# EAGLE design apple-mini (EAGLE 7.4.0)
Apple Mini 1 Schematic Source: http://github.com/sstallion/apple-mini/
AUTHOR: S. Stallion; REV: A; SUBTITLE: http://github.com/sstallion/apple-mini/; TITLE: APPLE MINI 1

## Sheet 1 of 3: I/O & Supply
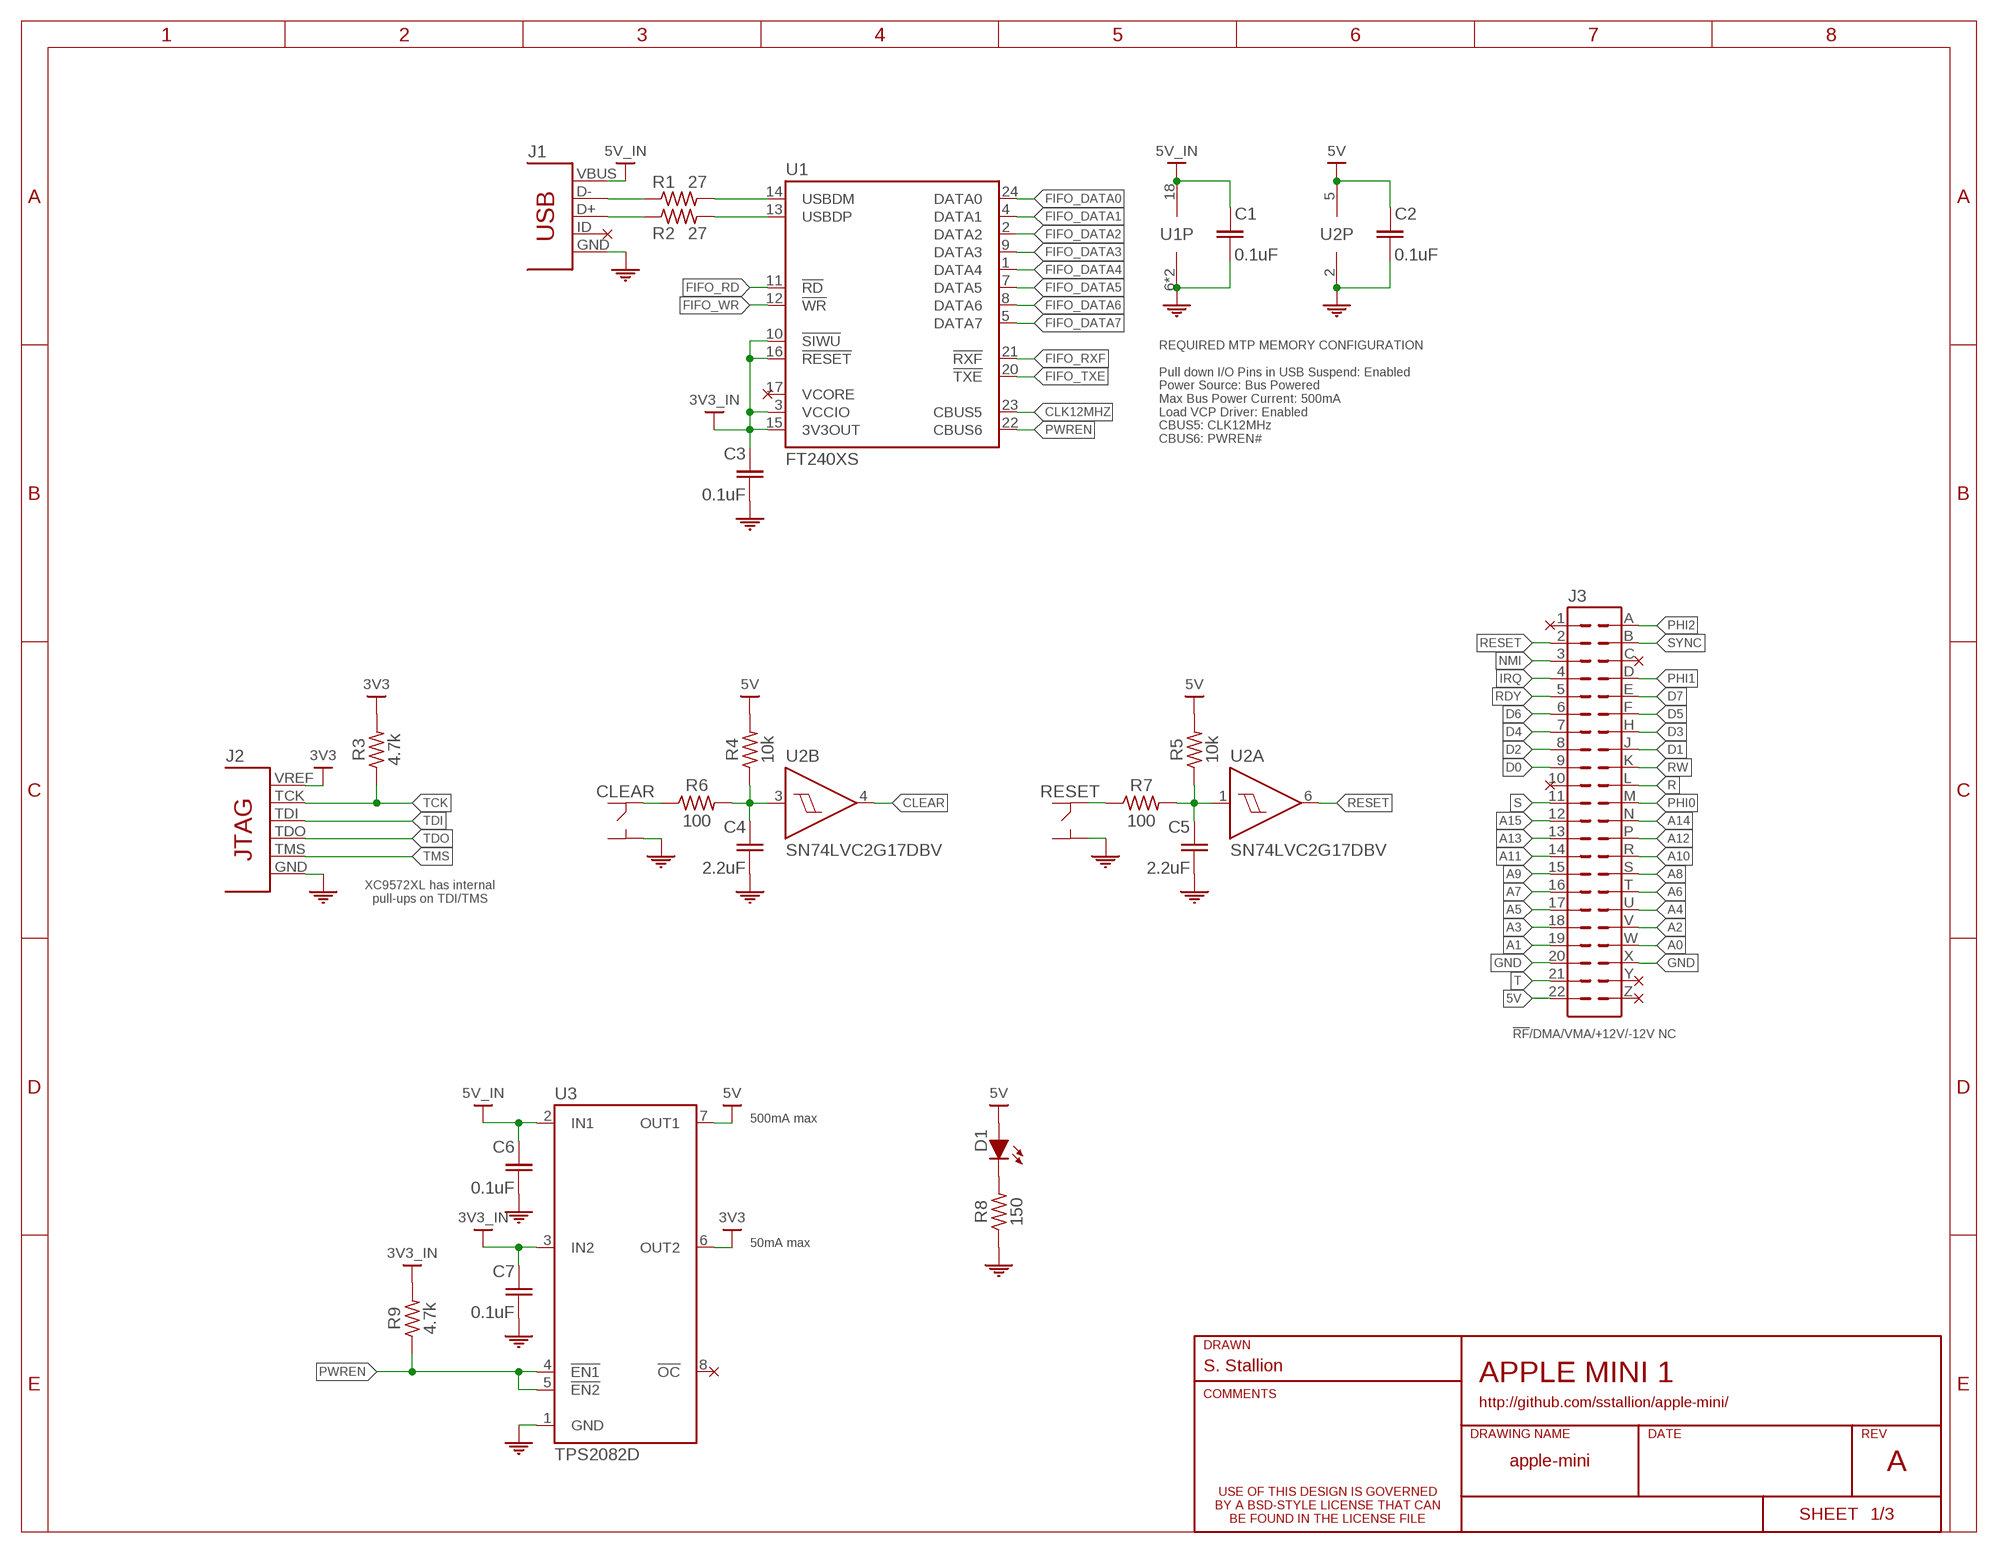
[diagram p0: schematic, sheet 1]
TITLE1 (TITLE): COMMENTS: N/A; SHEET_NAME: I/O & Supply

### Parts
C1  0.1uF  C0603  [0603]
C2  0.1uF  C0603  [0603]
C3  0.1uF  C0603  [0603]
C4  2.2uF  C0603  [0603]
C5  2.2uF  C0603  [0603]
C6  0.1uF  C0603  [0603]
C7  0.1uF  C0603  [0603]
CLEAR  TACTSW  [SMTR92]
D1  CHIPLED  [0603]
J1  USBMICRO  [10118193-0001LF]
J2  JTAG  [PH07-2-SMT]
J3  RBM22DRTN  [M22DRTN]
R1  27  R0402  [0402]
R2  27  R0402  [0402]
R3  4.7k  R0603  [0603]
R4  10k  R0603  [0603]
R5  10k  R0603  [0603]
R6  100  R0603  [0603]
R7  100  R0603  [0603]
R8  150  R0603  [0603]
R9  4.7k  R0603  [0603]
RESET  TACTSW  [SMTR92]
U1  FT240XS  [SSOP24]
U2  SN74LVC2G17DBV  [SOT23-6]
U3  TPS2082D  [SOIC8]

### Nets
3V3 [supply]: J2.2(VREF) R3.2 U3.6(OUT2) ; also sheet 3
3V3_IN [supply]: C3.1 C7.1 R9.2 U1.3(VCCIO) U1.10(!SIWU) U1.15(3V3OUT) U1.16(!RESET) U3.3(IN2)
5V [supply]: C2.1 D1.2 J3.22 R4.2 R5.2 U2.5(P:VCC) U3.7(OUT1) ; also sheet 2
5V_IN [supply]: C1.1 C6.1 J1.1 U1.18(VCC) U3.2(IN1)
A0: J3.W ; also sheet 2
A1: J3.19 ; also sheet 2
A2: J3.V ; also sheet 2
A3: J3.18 ; also sheet 2
A4: J3.U ; also sheet 2
A5: J3.17 ; also sheet 2
A6: J3.T ; also sheet 2
A7: J3.16 ; also sheet 2
A8: J3.S ; also sheet 2
A9: J3.15 ; also sheet 2
A10: J3.R ; also sheet 2
A11: J3.14 ; also sheet 2
A12: J3.P ; also sheet 2,3
A13: J3.13 ; also sheet 2,3
A14: J3.N ; also sheet 2,3
A15: J3.12 ; also sheet 2,3
CLEAR: U2.4(B:Y) ; also sheet 3
CLK12MHZ: U1.23(CBUS5) ; also sheet 3
D0: J3.9 ; also sheet 2
D1: J3.J ; also sheet 2
D2: J3.8 ; also sheet 2
D3: J3.H ; also sheet 2
D4: J3.7 ; also sheet 2
D5: J3.F ; also sheet 2
D6: J3.6 ; also sheet 2
D7: J3.E ; also sheet 2
FIFO_DATA0: U1.24(DATA0) ; also sheet 3
FIFO_DATA1: U1.4(DATA1) ; also sheet 3
FIFO_DATA2: U1.2(DATA2) ; also sheet 3
FIFO_DATA3: U1.9(DATA3) ; also sheet 3
FIFO_DATA4: U1.1(DATA4) ; also sheet 3
FIFO_DATA5: U1.7(DATA5) ; also sheet 3
FIFO_DATA6: U1.8(DATA6) ; also sheet 3
FIFO_DATA7: U1.5(DATA7) ; also sheet 3
FIFO_RD: U1.11(!RD) ; also sheet 3
FIFO_RXF: U1.21(!RXF) ; also sheet 3
FIFO_TXE: U1.20(!TXE) ; also sheet 3
FIFO_WR: U1.12(!WR) ; also sheet 3
GND [supply]: C1.2 C2.2 C3.2 C4.2 C5.2 C6.2 C7.2 CLEAR.3 CLEAR.4 J1.5 J1.6 J1.7 J1.8 J1.9 J2.3(GND) J2.5(GND) J2.7(GND) J2.9(GND) J2.11(GND) J3.20 J3.X R8.1 RESET.3 RESET.4 U1.6(GND) U1.19(GND) U2.2(P:GND) U3.1(GND) ; also sheet 2,3
IRQ: J3.4 ; also sheet 2
N$1: D1.1 R8.2
N$1_N: J1.2 R1.1
N$1_P: J1.3 R2.1
N$2: CLEAR.1 CLEAR.2 R6.1
N$2_N: R1.2 U1.14(USBDM)
N$2_P: R2.2 U1.13(USBDP)
N$3: R7.1 RESET.1 RESET.2
N$4: C4.1 R4.1 R6.2 U2.3(B:A)
N$5: C5.1 R5.1 R7.2 U2.1(A:A)
NMI: J3.3 ; also sheet 2
PHI0: J3.M ; also sheet 2,3
PHI1: J3.D ; also sheet 2
PHI2: J3.A ; also sheet 2,3
PWREN: R9.1 U1.22(CBUS6) U3.4(!EN1) U3.5(!EN2)
R: J3.L ; also sheet 3
RDY: J3.5 ; also sheet 2
RESET: J3.2 U2.6(A:Y) ; also sheet 2,3
RW: J3.K ; also sheet 2
S: J3.11 ; also sheet 3
SYNC: J3.B ; also sheet 2
T: J3.21 ; also sheet 3
TCK: J2.6(TCK) R3.1 ; also sheet 3
TDI: J2.10(TDI) ; also sheet 3
TDO: J2.8(TDO) ; also sheet 3
TMS: J2.4(TMS) ; also sheet 3
Unconnected: J1.4 J3.1 J3.10 J3.C J3.Y J3.Z U3.8(!OC)

### Notes on the sheet
- REQUIRED MTP MEMORY CONFIGURATION
  
  Pull down I/O Pins in USB Suspend: Enabled
  Power Source: Bus Powered
  Max Bus Power Current: 500mA
  Load VCP Driver: Enabled
  CBUS5: CLK12MHz
  CBUS6: PWREN#
- XC9572XL has internal
  pull-ups on TDI/TMS
- !RF!/DMA/VMA/+12V/-12V NC
- 500mA max
- 50mA max

## Sheet 2 of 3: MPU PIA & Memory
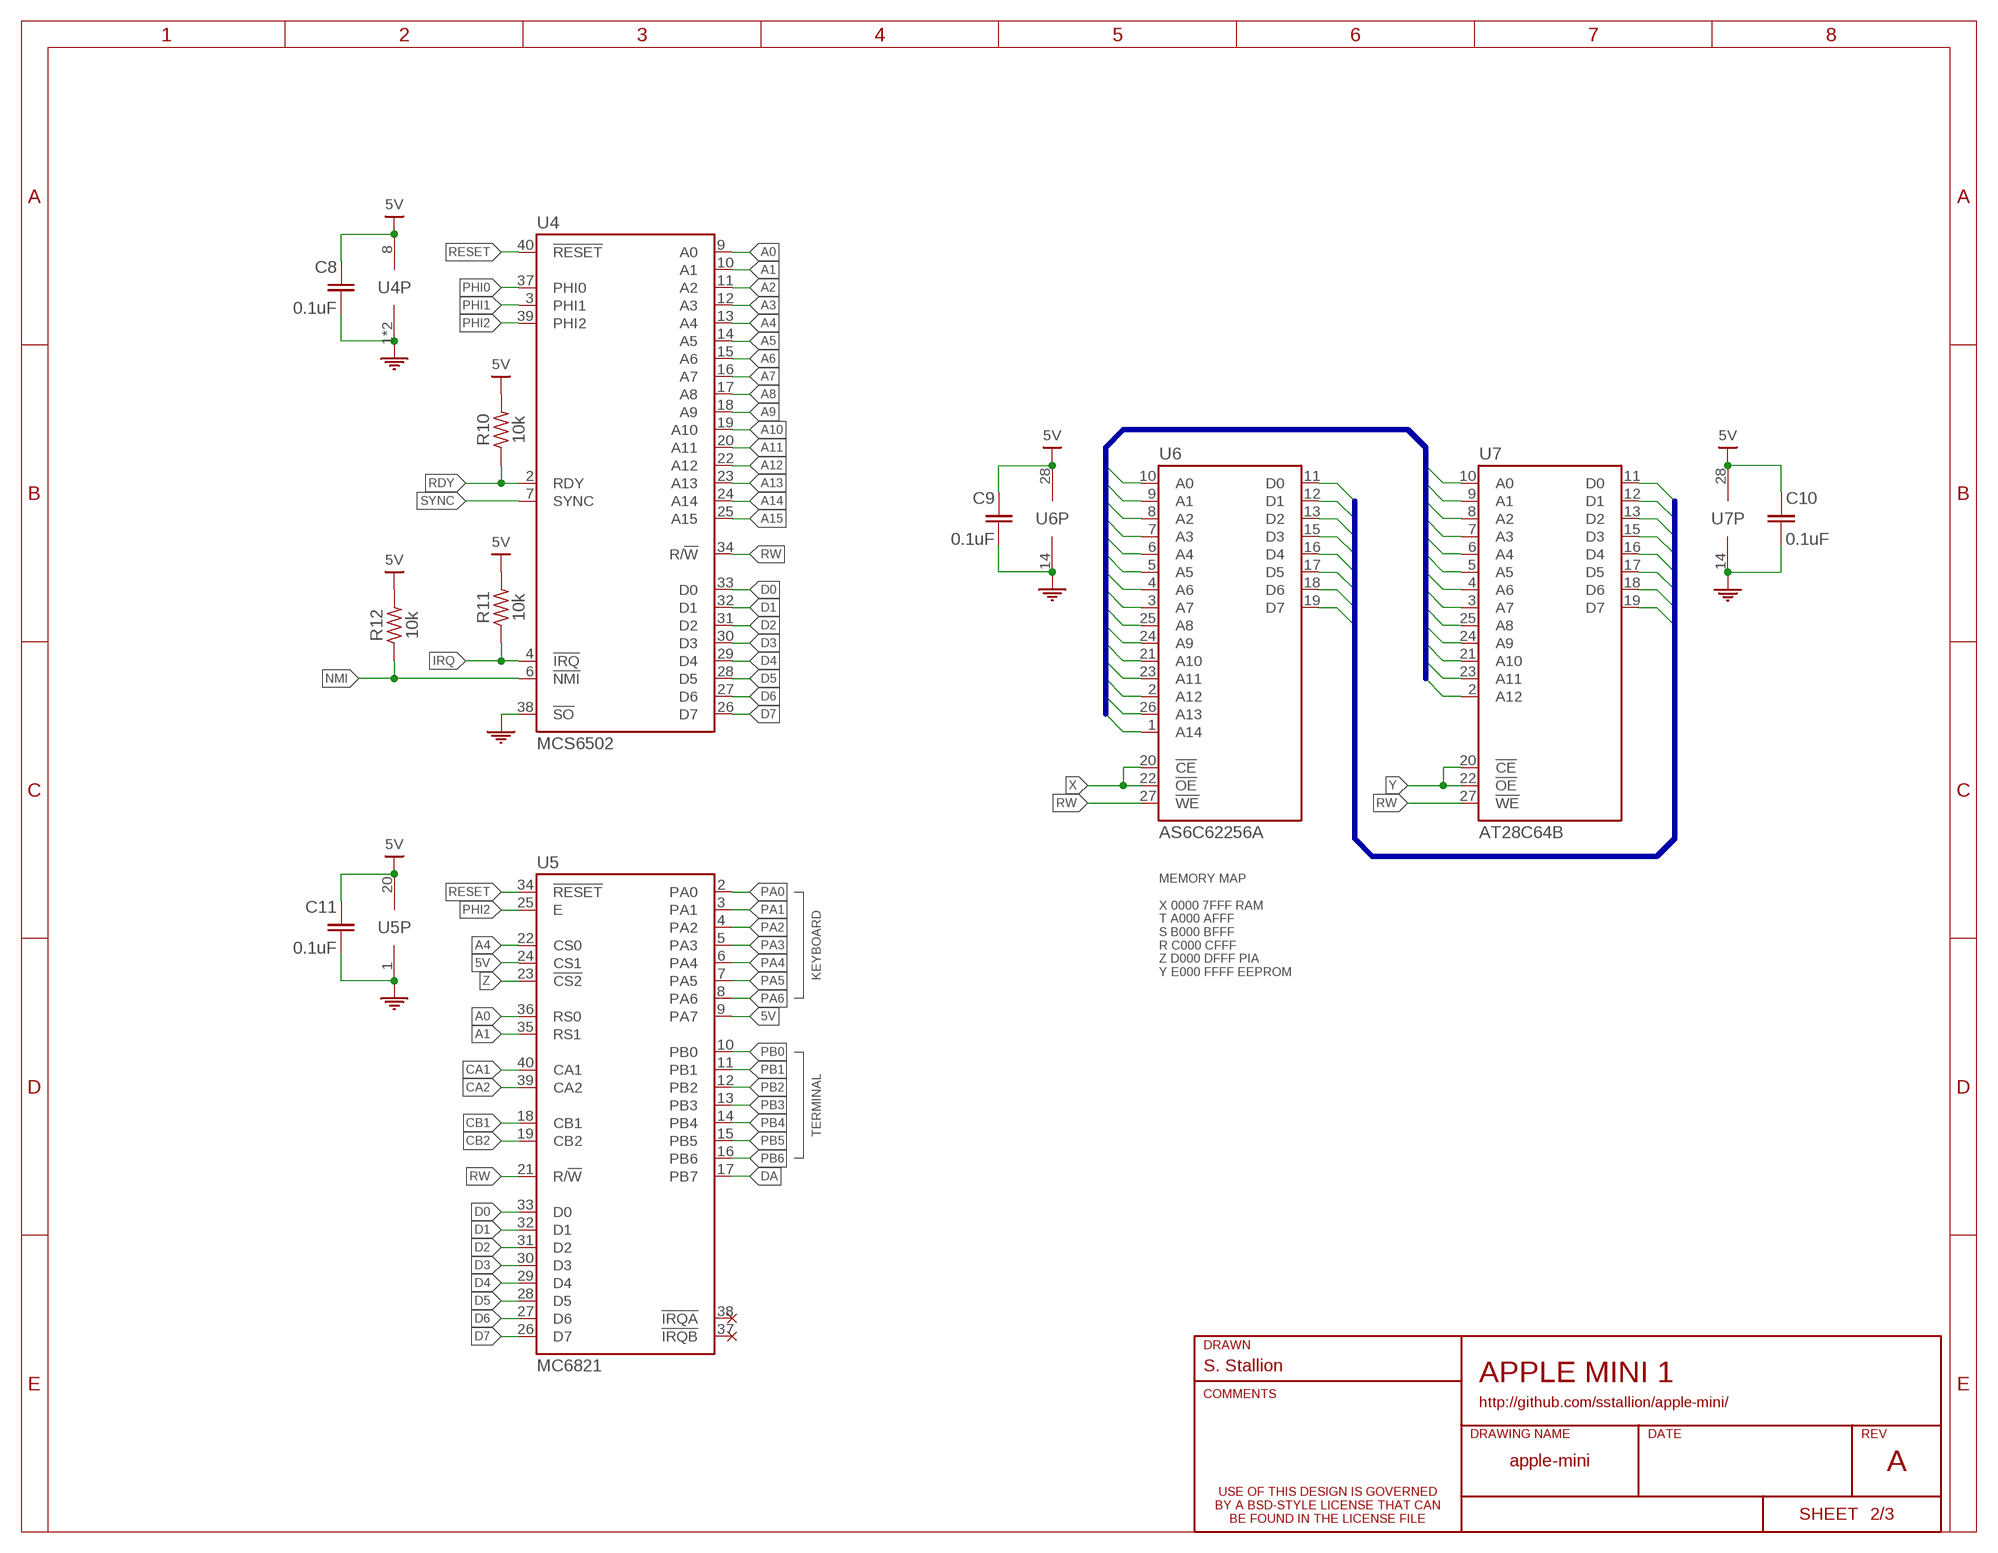
[diagram p1: schematic, sheet 2]
TITLE2 (TITLE): COMMENTS: N/A; SHEET_NAME: MPU PIA & Memory

### Parts
C8  0.1uF  C0603  [0603]
C9  0.1uF  C0603  [0603]
C10  0.1uF  C0603  [0603]
C11  0.1uF  C0603  [0603]
R10  10k  R0603  [0603]
R11  10k  R0603  [0603]
R12  10k  R0603  [0603]
U4  MCS6502  [DIP40]
U5  MC6821  [DIP40]
U6  AS6C62256A  [DIP28]
U7  AT28C64B  [DIP28]

### Nets
5V [supply]: C8.1 C9.1 C10.1 C11.1 R10.2 R11.2 R12.2 U4.8(VCC) U5.9(PA7) U5.20(VCC) U5.24(CS1) U6.28(VCC) U7.28(VCC) ; also sheet 1
A0: U4.9(A0) U5.36(RS0) U6.10(A0) U7.10(A0) ; also sheet 1
A1: U4.10(A1) U5.35(RS1) U6.9(A1) U7.9(A1) ; also sheet 1
A2: U4.11(A2) U6.8(A2) U7.8(A2) ; also sheet 1
A3: U4.12(A3) U6.7(A3) U7.7(A3) ; also sheet 1
A4: U4.13(A4) U5.22(CS0) U6.6(A4) U7.6(A4) ; also sheet 1
A5: U4.14(A5) U6.5(A5) U7.5(A5) ; also sheet 1
A6: U4.15(A6) U6.4(A6) U7.4(A6) ; also sheet 1
A7: U4.16(A7) U6.3(A7) U7.3(A7) ; also sheet 1
A8: U4.17(A8) U6.25(A8) U7.25(A8) ; also sheet 1
A9: U4.18(A9) U6.24(A9) U7.24(A9) ; also sheet 1
A10: U4.19(A10) U6.21(A10) U7.21(A10) ; also sheet 1
A11: U4.20(A11) U6.23(A11) U7.23(A11) ; also sheet 1
A12: U4.22(A12) U6.2(A12) U7.2(A12) ; also sheet 1,3
A13: U4.23(A13) U6.26(A13) ; also sheet 1,3
A14: U4.24(A14) U6.1(A14) ; also sheet 1,3
A15: U4.25(A15) ; also sheet 1,3
CA1: U5.40(CA1) ; also sheet 3
CA2: U5.39(CA2) ; also sheet 3
CB1: U5.18(CB1) ; also sheet 3
CB2: U5.19(CB2) ; also sheet 3
D0: U4.33(D0) U5.33(D0) U6.11(D0) U7.11(D0) ; also sheet 1
D1: U4.32(D1) U5.32(D1) U6.12(D1) U7.12(D1) ; also sheet 1
D2: U4.31(D2) U5.31(D2) U6.13(D2) U7.13(D2) ; also sheet 1
D3: U4.30(D3) U5.30(D3) U6.15(D3) U7.15(D3) ; also sheet 1
D4: U4.29(D4) U5.29(D4) U6.16(D4) U7.16(D4) ; also sheet 1
D5: U4.28(D5) U5.28(D5) U6.17(D5) U7.17(D5) ; also sheet 1
D6: U4.27(D6) U5.27(D6) U6.18(D6) U7.18(D6) ; also sheet 1
D7: U4.26(D7) U5.26(D7) U6.19(D7) U7.19(D7) ; also sheet 1
DA: U5.17(PB7) ; also sheet 3
GND [supply]: C8.2 C9.2 C10.2 C11.2 U4.1(GND) U4.21(GND) U4.38(!SO) U5.1(GND) U6.14(GND) U7.14(GND) ; also sheet 1,3
IRQ: R11.1 U4.4(!IRQ) ; also sheet 1
NMI: R12.1 U4.6(!NMI) ; also sheet 1
PA0: U5.2(PA0) ; also sheet 3
PA1: U5.3(PA1) ; also sheet 3
PA2: U5.4(PA2) ; also sheet 3
PA3: U5.5(PA3) ; also sheet 3
PA4: U5.6(PA4) ; also sheet 3
PA5: U5.7(PA5) ; also sheet 3
PA6: U5.8(PA6) ; also sheet 3
PB0: U5.10(PB0) ; also sheet 3
PB1: U5.11(PB1) ; also sheet 3
PB2: U5.12(PB2) ; also sheet 3
PB3: U5.13(PB3) ; also sheet 3
PB4: U5.14(PB4) ; also sheet 3
PB5: U5.15(PB5) ; also sheet 3
PB6: U5.16(PB6) ; also sheet 3
PHI0: U4.37(PHI0) ; also sheet 1,3
PHI1: U4.3(PHI1) ; also sheet 1
PHI2: U4.39(PHI2) U5.25(E) ; also sheet 1,3
RDY: R10.1 U4.2(RDY) ; also sheet 1
RESET: U4.40(!RESET) U5.34(!RESET) ; also sheet 1,3
RW: U4.34(R/!W) U5.21(R/!W) U6.27(!WE) U7.27(!WE) ; also sheet 1
SYNC: U4.7(SYNC) ; also sheet 1
X: U6.20(!CE) U6.22(!OE) ; also sheet 3
Y: U7.20(!CE) U7.22(!OE) ; also sheet 3
Z: U5.23(!CS2) ; also sheet 3
Unconnected: U5.37(!IRQB) U5.38(!IRQA)

### Buses
A[0..14]
D[0..7]

### Notes on the sheet
- MEMORY MAP
  
  X 0000 7FFF RAM
  T A000 AFFF
  S B000 BFFF
  R C000 CFFF
  Z D000 DFFF PIA
  Y E000 FFFF EEPROM
- KEYBOARD
- TERMINAL

## Sheet 3 of 3: CPLD
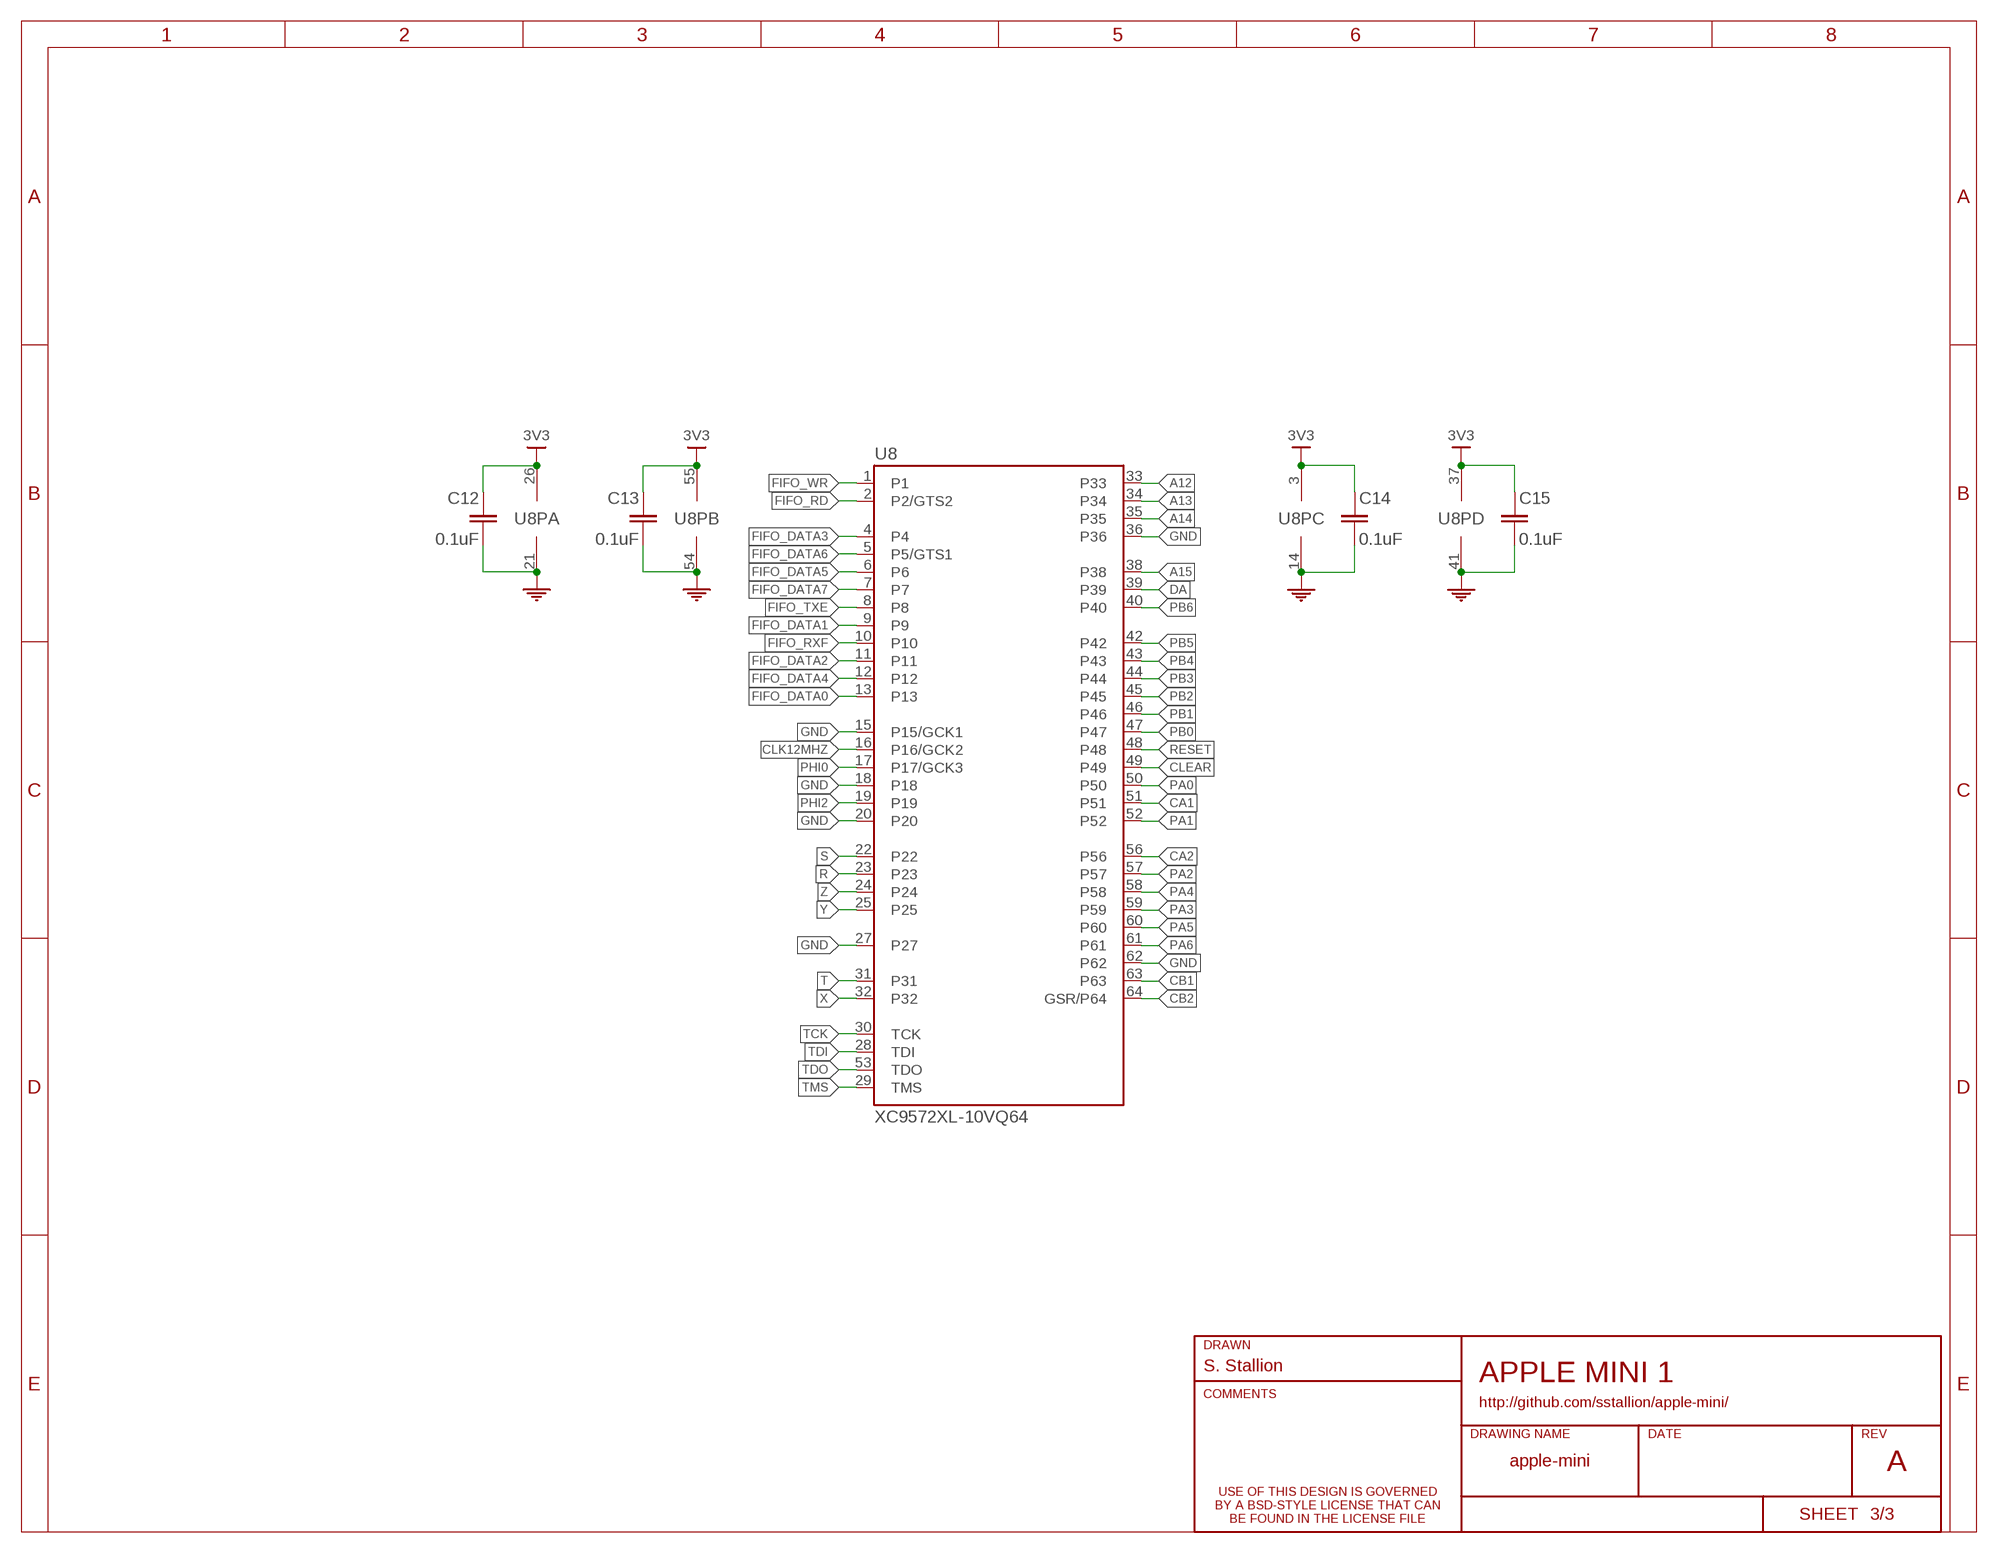
[diagram p2: schematic, sheet 3]
TITLE3 (TITLE): COMMENTS: N/A; SHEET_NAME: CPLD

### Parts
C12  0.1uF  C0603  [0603]
C13  0.1uF  C0603  [0603]
C14  0.1uF  C0603  [0603]
C15  0.1uF  C0603  [0603]
U8  XC9572XL-10VQ64  [VQFP64]

### Nets
3V3 [supply]: C12.1 C13.1 C14.1 C15.1 U8.3(VCC) U8.26(VCC) U8.37(VCC) U8.55(VCC) ; also sheet 1
A12: U8.33 ; also sheet 1,2
A13: U8.34 ; also sheet 1,2
A14: U8.35 ; also sheet 1,2
A15: U8.38 ; also sheet 1,2
CA1: U8.51 ; also sheet 2
CA2: U8.56 ; also sheet 2
CB1: U8.63 ; also sheet 2
CB2: U8.64(GSR/P64) ; also sheet 2
CLEAR: U8.49 ; also sheet 1
CLK12MHZ: U8.16(P16/GCK2) ; also sheet 1
DA: U8.39 ; also sheet 2
FIFO_DATA0: U8.13 ; also sheet 1
FIFO_DATA1: U8.9 ; also sheet 1
FIFO_DATA2: U8.11 ; also sheet 1
FIFO_DATA3: U8.4 ; also sheet 1
FIFO_DATA4: U8.12 ; also sheet 1
FIFO_DATA5: U8.6 ; also sheet 1
FIFO_DATA6: U8.5(P5/GTS1) ; also sheet 1
FIFO_DATA7: U8.7 ; also sheet 1
FIFO_RD: U8.2(P2/GTS2) ; also sheet 1
FIFO_RXF: U8.10 ; also sheet 1
FIFO_TXE: U8.8 ; also sheet 1
FIFO_WR: U8.1 ; also sheet 1
GND [supply]: C12.2 C13.2 C14.2 C15.2 U8.14(GND) U8.15(P15/GCK1) U8.18 U8.20 U8.21(GND) U8.27 U8.36 U8.41(GND) U8.54(GND) U8.62 ; also sheet 1,2
PA0: U8.50 ; also sheet 2
PA1: U8.52 ; also sheet 2
PA2: U8.57 ; also sheet 2
PA3: U8.59 ; also sheet 2
PA4: U8.58 ; also sheet 2
PA5: U8.60 ; also sheet 2
PA6: U8.61 ; also sheet 2
PB0: U8.47 ; also sheet 2
PB1: U8.46 ; also sheet 2
PB2: U8.45 ; also sheet 2
PB3: U8.44 ; also sheet 2
PB4: U8.43 ; also sheet 2
PB5: U8.42 ; also sheet 2
PB6: U8.40 ; also sheet 2
PHI0: U8.17(P17/GCK3) ; also sheet 1,2
PHI2: U8.19 ; also sheet 1,2
R: U8.23 ; also sheet 1
RESET: U8.48 ; also sheet 1,2
S: U8.22 ; also sheet 1
T: U8.31 ; also sheet 1
TCK: U8.30(TCK) ; also sheet 1
TDI: U8.28(TDI) ; also sheet 1
TDO: U8.53(TDO) ; also sheet 1
TMS: U8.29(TMS) ; also sheet 1
X: U8.32 ; also sheet 2
Y: U8.25 ; also sheet 2
Z: U8.24 ; also sheet 2

## Power pins joined to a net without a drawn wire
VCORE: U1.17(VCORE)

## Library data of the parts
C1-C3 C6-C15 = apple-mini:C: Capacitor; COMMENTS: 16V 10% X7R MLCC; MFR: Kemet; MFR_PARTNO: C0603C104K4RACTU; VENDOR: Digi-Key; VENDOR_PARTNO: 399-1096-1-ND
C4 C5 = apple-mini:C: Capacitor; COMMENTS: 16V 10% X5R MLCC; MFR: Kemet; MFR_PARTNO: C0603C225K4PACTU; VENDOR: Digi-Key; VENDOR_PARTNO: 399-7886-1-ND
CLEAR RESET = apple-mini:TACTSW: C&K Components PTS645 Series 6mm Tact Switch Source: http://www.ck-components.com/14409/pts645_8sept11.pdf/; COMMENTS: 12V 50mA; MFR: C&K Components; MFR_PARTNO: PTS645SL50SMTR92 LFS; VENDOR: Digi-Key; VENDOR_PARTNO: CKN9088CT-ND
D1 = apple-mini:CHIPLED: Chip LED; COMMENTS: 2.0-2.5V 20mA; MFR: Lite-On; MFR_PARTNO: LTST-C190KGKT; VENDOR: Digi-Key; VENDOR_PARTNO: 160-1435-1-ND
J1 = apple-mini:USBMICRO: FCI Micro USB Type B Receptacle Source: http://portal.fciconnect.com/Comergent//fci/drawing/10118193.pdf; MFR: FCI; MFR_PARTNO: 10118193-0001LF; VENDOR: Digi-Key; VENDOR_PARTNO: 609-4616-1-ND
J2 = apple-mini:JTAG: Xilinx JTAG Header Source: http://www.xilinx.com/support/documentation/data_sheets/ds593.pdf; MFR: Molex; MFR_PARTNO: 0878321420; VENDOR: Digi-Key; VENDOR_PARTNO: WM18641-ND
J3 = apple-mini:*M22D: Sullins 44 Contact Female Card Edge Connector .156” [3.96 mm] Contact Centers, .431” [10.95 mm] Insulator Height, Dip Solder/Eyelet/Right Angle Source: http://www.sullinscorp.com/catalogs/65_PAGE70-71_.156_LP_DS_EYE_RA.pdf; MFR: Sullins; MFR_PARTNO: RBM22DRTN; VENDOR: Digi-Key; VENDOR_PARTNO: RBM22DRTN-ND
R1 R2 = apple-mini:R: Resistor; COMMENTS: 5% 1/16W; MFR: Yageo; MFR_PARTNO: RC0402JR-0727RL; VENDOR: Digi-Key; VENDOR_PARTNO: 311-27JRCT-ND
R3 R9 = apple-mini:R: Resistor; COMMENTS: 5% 1/10W; MFR: Yageo; MFR_PARTNO: RC0603JR-074K7L; VENDOR: Digi-Key; VENDOR_PARTNO: 311-4.7KGRCT-ND
R4 R5 R10-R12 = apple-mini:R: Resistor; COMMENTS: 5% 1/10W; MFR: Yageo; MFR_PARTNO: RC0603JR-0710KL; VENDOR: Digi-Key; VENDOR_PARTNO: 311-10KGRCT-ND
R6 R7 = apple-mini:R: Resistor; COMMENTS: 5% 1/4W; MFR: Rohm Semiconductor; MFR_PARTNO: ESR03EZPJ101; VENDOR: Digi-Key; VENDOR_PARTNO: RHM100DCT-ND
R8 = apple-mini:R: Resistor; COMMENTS: 5% 1/4W; MFR: Rohm Semiconductor; MFR_PARTNO: ESR03EZPJ181; VENDOR: Digi-Key; VENDOR_PARTNO: RHM180DCT-ND
U1 = apple-mini:FT240X: FTDI FT240X Full Speed USB to 8-bit FIFO This USB2.0 Full Speed IC offers a compact bridge to 8 bit wide FIFO interfaces. The device is a FIFO, capable of operating up to 1 MByte/s, with low power consumption (8mA). The FT240X includes the complete FT-X series feature set and enables USB to be added into a system design quickly and easily over a 8 bit wide FIFO interface. Source: http://www.ftdichip.com/Support/Documents/DataSheets/ICs/DS_FT240X.pdf; MFR: FTDI; MFR_PARTNO: FT240XS-U; VENDOR: Digi-Key; VENDOR_PARTNO: 768-1158-5-ND
U2 = apple-mini:SN74LVC2G17: Texas Instruments SN74LVC2G17 Dual Schmitt-Trigger Buffer The SN74LVC2G17 device contains two buffers and performs the Boolean function Y = A. The device functions as two independent buffers, but because of Schmitt action, it may have different input threshold levels for positive-going (VT+) and negative-going (VT–) signals. Source: http://www.ti.com/lit/ds/symlink/sn74lvc2g17.pdf; MFR: Texas Instruments; MFR_PARTNO: SN74LVC2G17DBVR; VENDOR: Digi-Key; VENDOR_PARTNO: 296-13012-1-ND
U3 = apple-mini:TPS2082: Texas Instruments TPS2082 Power Distribution Switch The TPS2080, TPS2081, and TPS2082 dual and the TPS2085, TPS2086 and TPS2087 quad power-distribution switches are intended for applications where heavy capacitive loads and short circuits are likely to be encountered. Source: http://www.ti.com/lit/ds/symlink/tps2080.pdf; MFR: Texas Instruments; MFR_PARTNO: TPS2082D; VENDOR: Digi-Key; VENDOR_PARTNO: 296-3433-5-ND
U4 = apple-mini:MCS6502: MOS Technology 6502 Microprocessor (MPU) The 6500 Series Microprocessors represent the first totally software compatible microprocessor family. This family of products includes a range of software compatible microprocessors which provide a selection of addressable memory range, interrupt options and on-chip clock oscillators and drivers. Source: http://www.jameco.com/Jameco/Products/ProdDS/43191.pdf; MFR: MOS Technology; MFR_PARTNO: MCS6502; VENDOR: Jameco; VENDOR_PARTNO: 43191
U5 = apple-mini:MC6821: Motorola MC6821 Peripheral Interface Adapter (PIA) The MC6821 Peripheral Interface Adapter provides the universal means of interfacing peripheral equipment to the M6800 family of microprocessors. This device is capable of interfacing the MPU to peripherals through two 8-bit bidirectional peripheral data buses and four control lines. No external logic is required for interfacing to most peripheral devices. Source: http://www.jameco.com/Jameco/Products/ProdDS/43596MOT.pdf; MFR: Motorola; MFR_PARTNO: MC6821; VENDOR: Jameco; VENDOR_PARTNO: 43596
U6 = apple-mini:AS6C62256A: Alliance Memory AS6C2256A 32K X 8-bit Low Power CMOS SRAM The AS6C62256A is a static RAM manufactured using a CMOS process technology with the following operating modes: Read Standby Write Data Retention The memory array is based on a 6-transistor cell. Source: http://www.alliancememory.com/pdf/AS6C62256A.pdf; MFR: Alliance Memory; MFR_PARTNO: AS6C62256A-70PCN; VENDOR: Digi-Key; VENDOR_PARTNO: 1450-1182-5-ND
U7 = apple-mini:AT28C64B: Atmel AT28C64B 64K (8K x 8) Parallel EEPROM The AT28C64B is a high-performance electrically-erasable and programmable readonly memory (EEPROM). Its 64K of memory is organized as 8,192 words by 8 bits. Manufactured with Atmel’s advanced nonvolatile CMOS technology, the device offers access times to 150 ns with power dissipation of just 220 mW. When the device is deselected, the CMOS standby current is less than 100 µA. Source: http://www.atmel.com/Images/doc0270.pdf; MFR: Atmel; MFR_PARTNO: AT28C64B-15PU; VENDOR: Digi-Key; VENDOR_PARTNO: AT28C64B-15PU-ND
U8 = apple-mini:XC9572XL-*: Xilinx XC9572XL High Performance CPLD The XC9572XL is a 3.3V CPLD targeted for high-performance, low-voltage applications in leading-edge communications and computing systems. It is comprised of four 54V18 Function Blocks, providing 1,600 usable gates with propagation delays of 5 ns. Source: http://www.xilinx.com/support/documentation/data_sheets/ds057.pdf; MFR: Xilinx; MFR_PARTNO: XC9572XL-10VQG64C; VENDOR: Digi-Key; VENDOR_PARTNO: 122-1388-ND

## Net classes
0 default: width 0.203 mm
1 supply: width 0.305 mm

## Board
Apple Mini 1 Board Layout Source: http://github.com/sstallion/apple-mini/
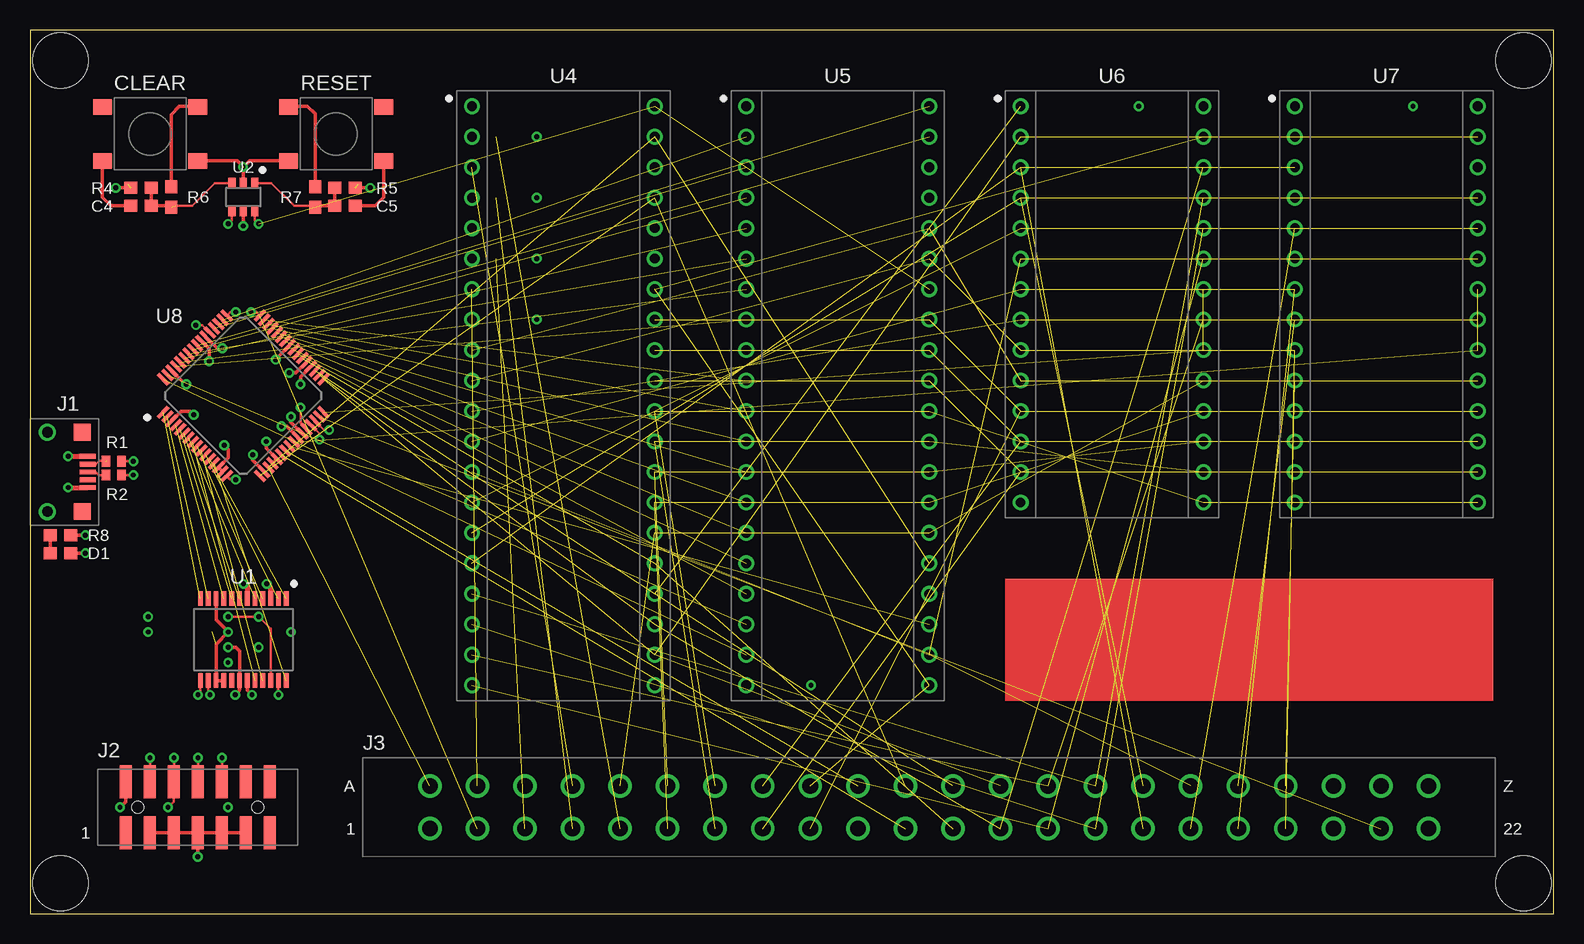
[diagram p3: board, top side]
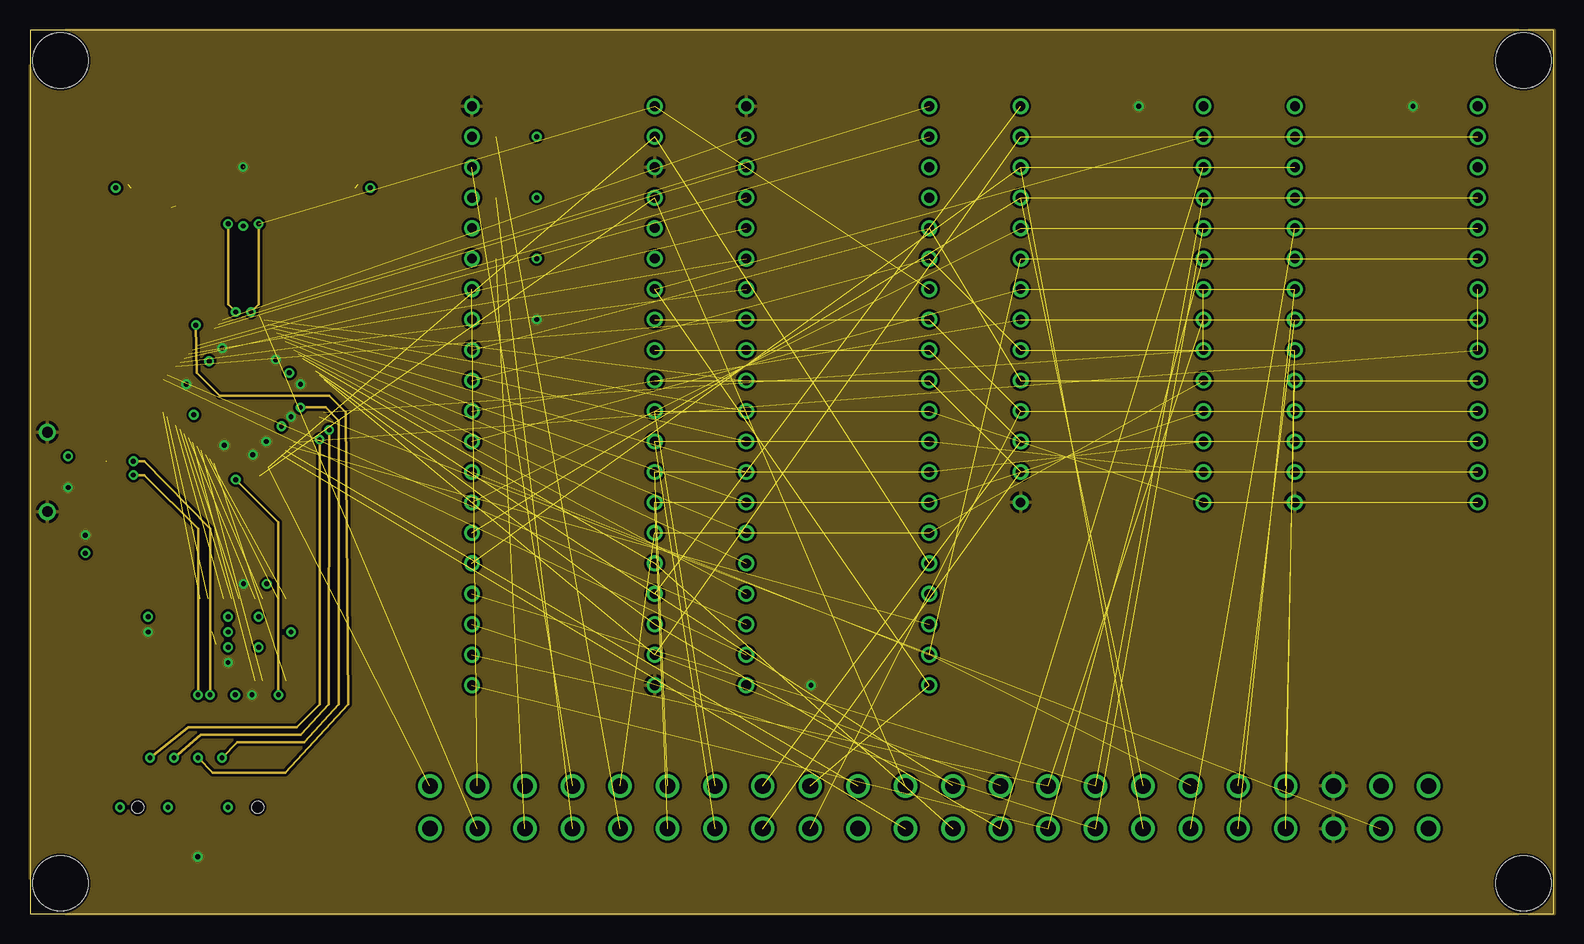
[diagram p4: board, inner layer Ground]
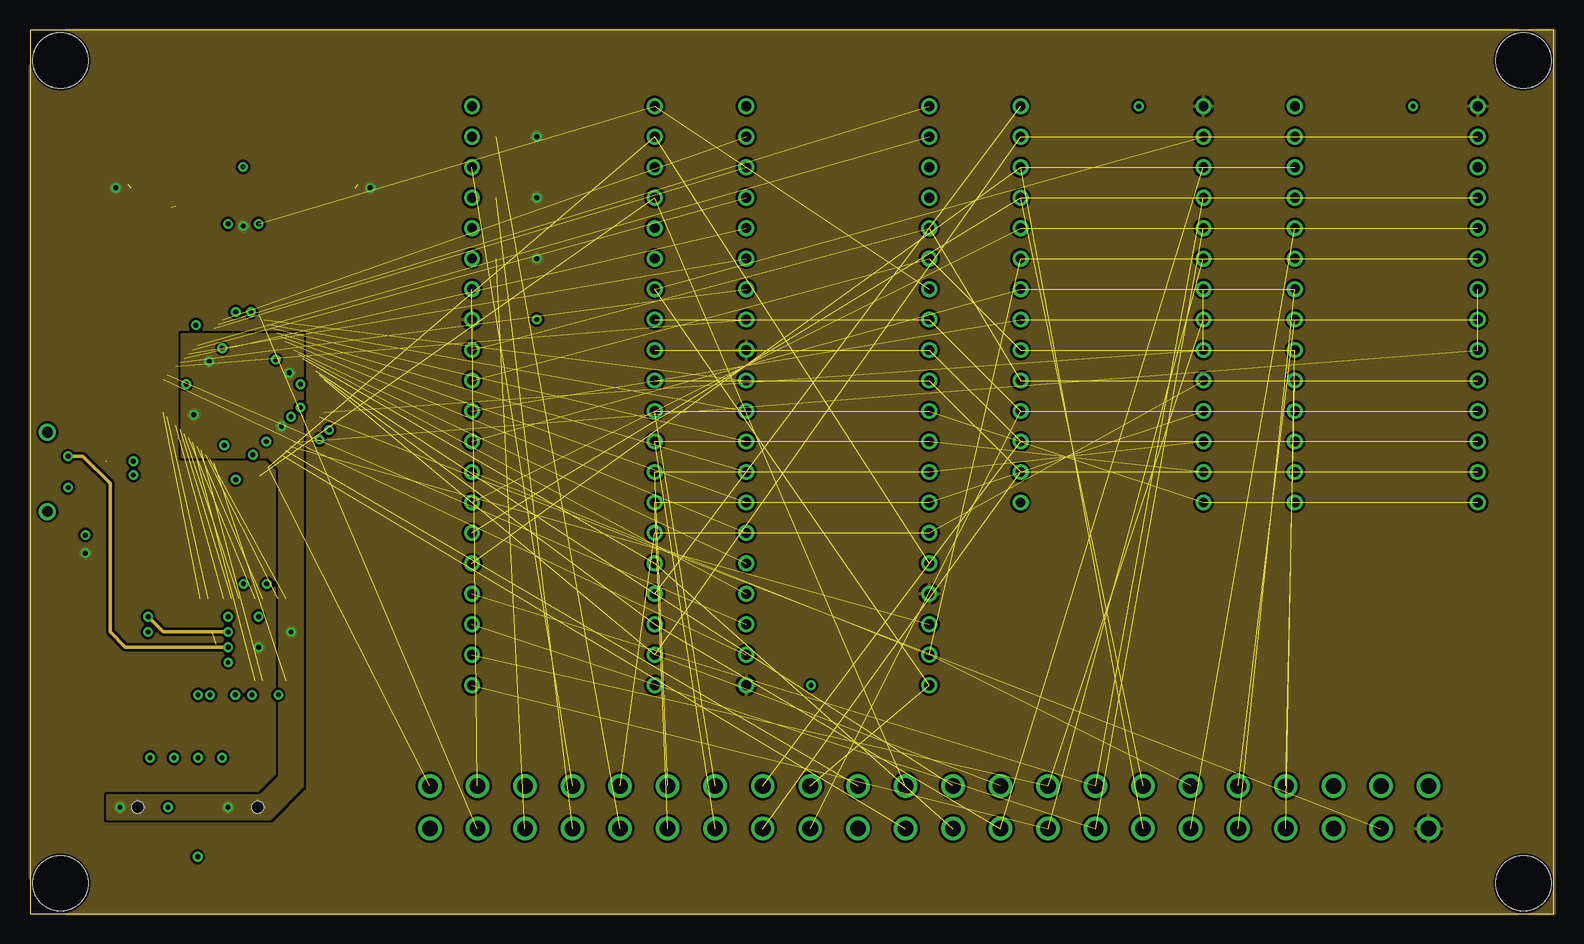
[diagram p5: board, inner layer Power]
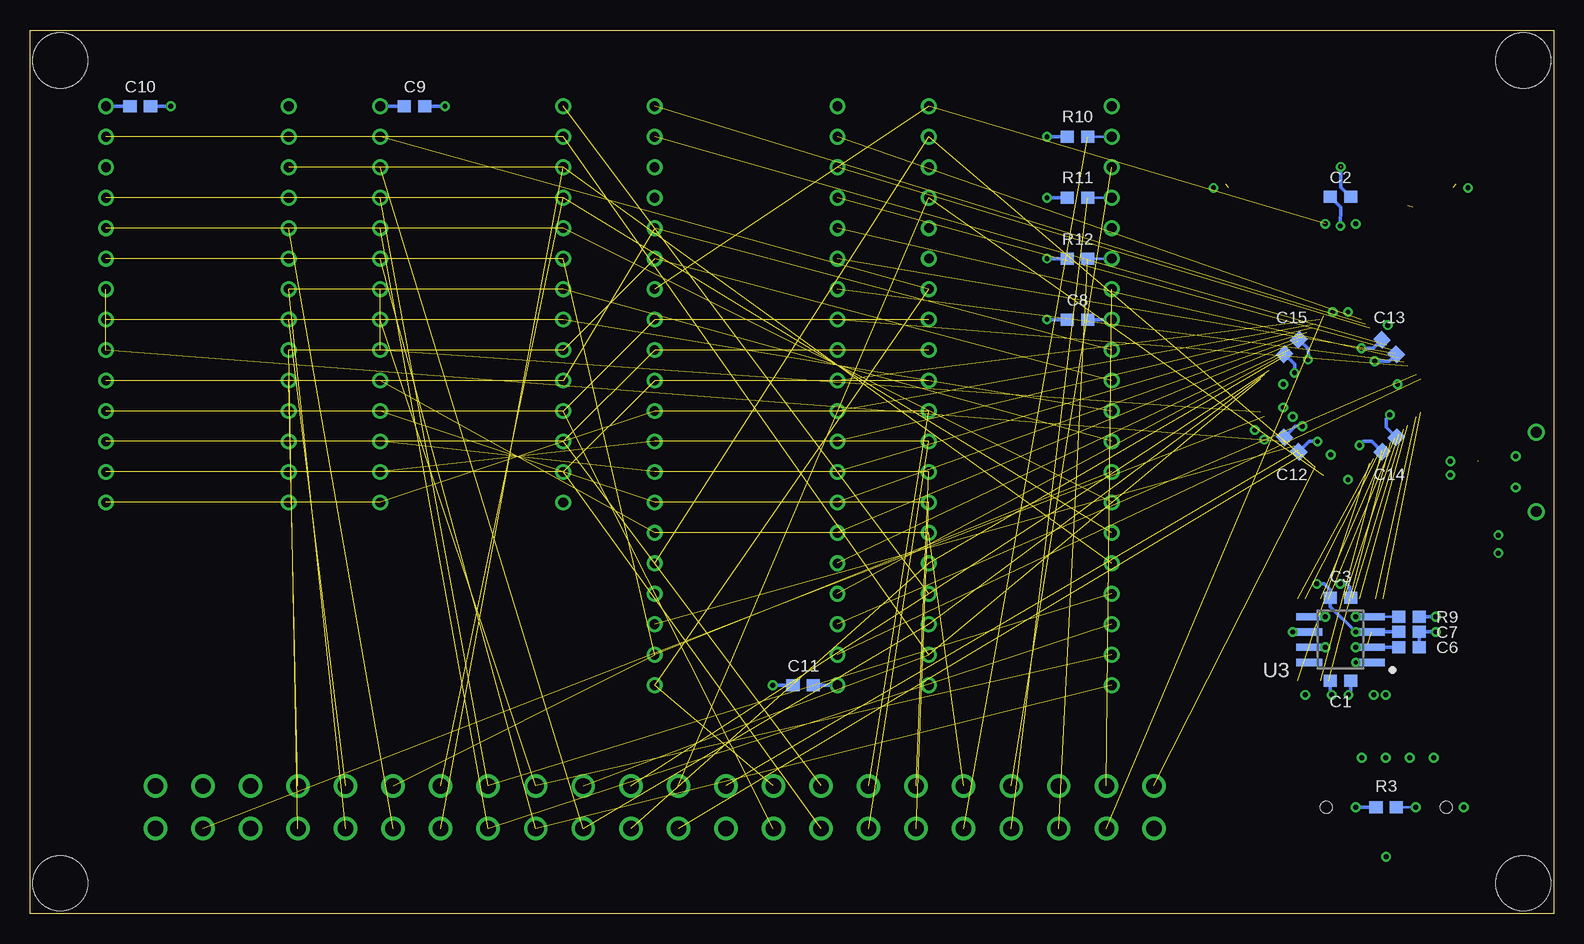
[diagram p6: board, bottom side, seen from below]

Size 126.98 x 73.66 mm. Coordinates in mm from the lower left corner, seen from the top.
Outline: 0,0 126.98,0 126.98,73.66 0,73.66 0,0
Copper layers (1+2*15+16): Top 0.034975mm / dielectric 10mil / Ground 0.034975mm / dielectric 40mil / Power 0.034975mm / dielectric 10mil / Bottom 0.034975mm
Design rules "apple-mini": minimum track width 7mil, minimum drill 14mil, track to track 7mil, track to pad 7mil, pad to pad 7mil, via to via 7mil, smd to smd 0mil, copper to edge 0mil, drill to drill 7mil, minimum pad ring 10mil, minimum via ring 8mil, stop-mask expansion 4mil, vias tented up to drill 24mil, thermal gap 10mil
Holes 4.57 mm at 2.54,2.54 124.46,2.54 2.54,71.12 124.46,71.12
tRestrict: area 81,17.5 to 122.2,28.3

### Footprints (pad centres in the part's own frame; a part is rotated, then mirrored left to right if it is on the bottom)
0603 = smd 1.1 x 1: 1 -0.85,0; 2 0.85,0
SMTR92 = smd 1.55 x 1.3: 1 -3.975,2.25; 2 3.975,2.25; 3 -3.975,-2.25; 4 3.975,-2.25
10118193-0001LF = smd 1.35 x 0.4: 1 4.8,1.3; 2 4.8,0.65; 3 4.8,0; 4 4.8,-0.65; 5 4.8,-1.3 | smd 1.4 x 1.4: 6 4.35,-3.3; 9 4.35,3.3 | drill 0.9: 7 1.45,-3.3; 8 1.45,3.3
PH07-2-SMT = smd 1 x 2.75: 1 -6,-2.125; 2 -6,2.125; 3 -4,-2.125; 4 -4,2.125; 5 -2,-2.125; 6 -2,2.125; 7 0,-2.125; 8 0,2.125; 9 2,-2.125; 10 2,2.125; 11 4,-2.125; 12 4,2.125; 13 6,-2.125; 14 6,2.125 | hole 1: -5,0; 5,0
M22DRTN = drill 1.3: 1 -41.605,-1.778; 2 -37.643,-1.778; 3 -33.68,-1.778; 4 -29.718,-1.778; 5 -25.756,-1.778; 6 -21.793,-1.778; 7 -17.831,-1.778; 8 -13.868,-1.778; 9 -9.906,-1.778; 10 -5.944,-1.778; 11 -1.981,-1.778; 12 1.981,-1.778; 13 5.944,-1.778; 14 9.906,-1.778; 15 13.868,-1.778; 16 17.831,-1.778; 17 21.793,-1.778; 18 25.756,-1.778; 19 29.718,-1.778; 20 33.68,-1.778; 21 37.643,-1.778; 22 41.605,-1.778; A -41.605,1.778; B -37.643,1.778; C -33.68,1.778; D -29.718,1.778; E -25.756,1.778; F -21.793,1.778; H -17.831,1.778; J -13.868,1.778; K -9.906,1.778; L -5.944,1.778; M -1.981,1.778; N 1.981,1.778; P 5.944,1.778; R 9.906,1.778; S 13.868,1.778; T 17.831,1.778; U 21.793,1.778; V 25.756,1.778; W 29.718,1.778; X 33.68,1.778; Y 37.643,1.778; Z 41.605,1.778
0402 = smd 0.7 x 0.9: 1 -0.65,0; 2 0.65,0
SSOP24 = smd 0.4 x 1.2: 1 -3.575,-3.42; 2 -2.925,-3.42; 3 -2.275,-3.42; 4 -1.625,-3.42; 5 -0.975,-3.42; 6 -0.325,-3.42; 7 0.325,-3.42; 8 0.975,-3.42; 9 1.625,-3.42; 10 2.275,-3.42; 11 2.925,-3.42; 12 3.575,-3.42; 13 3.575,3.42; 14 2.925,3.42; 15 2.275,3.42; 16 1.625,3.42; 17 0.975,3.42; 18 0.325,3.42; 19 -0.325,3.42; 20 -0.975,3.42; 21 -1.625,3.42; 22 -2.275,3.42; 23 -2.925,3.42; 24 -3.575,3.42
SOT23-6 = smd 0.6 x 0.9: 1 -0.95,-1.15; 2 0,-1.15; 3 0.95,-1.15; 4 0.95,1.15; 5 0,1.15; 6 -0.95,1.15
SOIC8 = smd 0.6 x 2.2: 1 -1.905,-2.6; 2 -0.635,-2.6; 3 0.635,-2.6; 4 1.905,-2.6; 5 1.905,2.6; 6 0.635,2.6; 7 -0.635,2.6; 8 -1.905,2.6
DIP40 = drill 0.813: 1 -24.13,-7.62; 2 -21.59,-7.62; 3 -19.05,-7.62; 4 -16.51,-7.62; 5 -13.97,-7.62; 6 -11.43,-7.62; 7 -8.89,-7.62; 8 -6.35,-7.62; 9 -3.81,-7.62; 10 -1.27,-7.62; 11 1.27,-7.62; 12 3.81,-7.62; 13 6.35,-7.62; 14 8.89,-7.62; 15 11.43,-7.62; 16 13.97,-7.62; 17 16.51,-7.62; 18 19.05,-7.62; 19 21.59,-7.62; 20 24.13,-7.62; 21 24.13,7.62; 22 21.59,7.62; 23 19.05,7.62; 24 16.51,7.62; 25 13.97,7.62; 26 11.43,7.62; 27 8.89,7.62; 28 6.35,7.62; 29 3.81,7.62; 30 1.27,7.62; 31 -1.27,7.62; 32 -3.81,7.62; 33 -6.35,7.62; 34 -8.89,7.62; 35 -11.43,7.62; 36 -13.97,7.62; 37 -16.51,7.62; 38 -19.05,7.62; 39 -21.59,7.62; 40 -24.13,7.62
DIP28 = drill 0.813: 1 -16.51,-7.62; 2 -13.97,-7.62; 3 -11.43,-7.62; 4 -8.89,-7.62; 5 -6.35,-7.62; 6 -3.81,-7.62; 7 -1.27,-7.62; 8 1.27,-7.62; 9 3.81,-7.62; 10 6.35,-7.62; 11 8.89,-7.62; 12 11.43,-7.62; 13 13.97,-7.62; 14 16.51,-7.62; 15 16.51,7.62; 16 13.97,7.62; 17 11.43,7.62; 18 8.89,7.62; 19 6.35,7.62; 20 3.81,7.62; 21 1.27,7.62; 22 -1.27,7.62; 23 -3.81,7.62; 24 -6.35,7.62; 25 -8.89,7.62; 26 -11.43,7.62; 27 -13.97,7.62; 28 -16.51,7.62
VQFP64 = smd 1.2 x 0.3: 1 -5.7,3.75; 2 -5.7,3.25; 3 -5.7,2.75; 4 -5.7,2.25; 5 -5.7,1.75; 6 -5.7,1.25; 7 -5.7,0.75; 8 -5.7,0.25; 9 -5.7,-0.25; 10 -5.7,-0.75; 11 -5.7,-1.25; 12 -5.7,-1.75; 13 -5.7,-2.25; 14 -5.7,-2.75; 15 -5.7,-3.25; 16 -5.7,-3.75; 33 5.7,-3.75; 34 5.7,-3.25; 35 5.7,-2.75; 36 5.7,-2.25; 37 5.7,-1.75; 38 5.7,-1.25; 39 5.7,-0.75; 40 5.7,-0.25; 41 5.7,0.25; 42 5.7,0.75; 43 5.7,1.25; 44 5.7,1.75; 45 5.7,2.25; 46 5.7,2.75; 47 5.7,3.25; 48 5.7,3.75 | smd 0.3 x 1.2: 17 -3.75,-5.7; 18 -3.25,-5.7; 19 -2.75,-5.7; 20 -2.25,-5.7; 21 -1.75,-5.7; 22 -1.25,-5.7; 23 -0.75,-5.7; 24 -0.25,-5.7; 25 0.25,-5.7; 26 0.75,-5.7; 27 1.25,-5.7; 28 1.75,-5.7; 29 2.25,-5.7; 30 2.75,-5.7; 31 3.25,-5.7; 32 3.75,-5.7; 49 3.75,5.7; 50 3.25,5.7; 51 2.75,5.7; 52 2.25,5.7; 53 1.75,5.7; 54 1.25,5.7; 55 0.75,5.7; 56 0.25,5.7; 57 -0.25,5.7; 58 -0.75,5.7; 59 -1.25,5.7; 60 -1.75,5.7; 61 -2.25,5.7; 62 -2.75,5.7; 63 -3.25,5.7; 64 -3.75,5.7

### Placement (x,y rotation side)
C1  17.78,19.43 180 bottom
C2  17.78,59.75 0 bottom
C3  17.78,26.35 0 bottom
C4  9.25,59 180 top
C5  26.25,59 0 top
C6  12.06,22.23 0 bottom
C7  12.06,23.5 0 bottom
C8  39.69,49.53 180 bottom
C9  94.93,67.31 0 bottom
C10  117.79,67.31 0 bottom
C11  62.55,19.05 180 bottom
C12  21.84,39.12 315 bottom
C13  13.72,47.24 135 bottom
C14  13.72,39.12 225 bottom
C15  21.84,47.24 45 bottom
CLEAR  10,65 0 top
D1  2.54,30.07 0 top
J1  0,36.83 0 top
J2  13.97,8.89 0 top
J3  74.93,8.89 0 top
R1  6.99,37.73 0 top
R2  6.99,36.58 0 top
R3  13.97,8.89 180 bottom
R4  9.25,60.5 180 top
R5  26.25,60.5 0 top
R6  11.75,59.75 270 top
R7  23.75,59.75 270 top
R8  2.54,31.57 180 top
R9  12.06,24.77 0 bottom
R10  39.69,64.77 180 bottom
R11  39.69,59.69 180 bottom
R12  39.69,54.61 180 bottom
RESET  25.5,65 0 top
U1  17.78,22.86 180 top
U2  17.78,59.75 180 top
U3  17.78,22.86 90 bottom
U4  44.45,43.18 270 top
U5  67.31,43.18 270 top
U6  90.17,50.8 270 top
U7  113.03,50.8 270 top
U8  17.78,43.18 45 top

### Tracks (layer width: path | path; a pad name or v marks a point on that pad's centre or on a via)
3V3  (via drill 0.41, 0.41 pad 0.81)
  Top 0.305: J2.2 7.97,9.36 v7.5,8.89 | v13.65,41.59 13.34,41.91 12.62,41.91 U8.3 | v21.6,45.09 22.16,45.09 U8.37 | U8.26 21.38,40.64 v20.95,40.64 | v14.92,46.06 14.92,47.1 U8.55
  Bottom 0.305: v16.5,8.89 R3.2 | U3.6 v21.75,23.5 | 13.16,39.83 arc45 C14.1 13.97,40.57 13.97,41.27 v13.65,41.59 | 13.12,46.58 C13.1 13.72,46.04 14.9,46.04 v14.92,46.06 | C12.1 21.52,40.64 v20.95,40.64 | C15.1 21.6,45.8 v21.6,45.09
  pour Power: 6.5,9.84 19.21,9.84 20.8,11.43 20.8,37.15 19.84,38.1 12.7,38.1 12.7,48.26 22.7,48.26 22.7,10.64 20,7.94 6.5,7.94
3V3_IN  (via drill 0.41, 0.41 pad 0.81)  (1 unrouted)
  Top 0.305: U1.16 U1.15 15.51,22.49 v16.51,23.5 15.51,24.5 U1.10
  Top 0.406: U1.3 20.05,27.18 v19.74,27.5
  Power 0.305: v9.84,24.77 11.11,23.5 v16.51,23.5
  Bottom 0.305: 18.75,26.47 18.95,26.67 | 18.95,26.04 C3.1 18.63,25.61 v16.51,23.5 C7.1 | v19.74,27.5 19.12,27.5 18.62,27 C3.1 | R9.2 9.86,24.75 v9.84,24.77
  Bottom 0.406: C3.1
  Bottom 0.61: 18.75,26.47 C3.1 18.65,26.38
5V  (via drill 0.41)  (2 unrouted)
  Top 0.305: 17.75,58.32 U2.5 v17.78,57.33 | 27.5,60.65 27.35,60.8 | 8,60.65 8.15,60.8 | v28.35,60.5 R5.2 | R4.2 v7.15,60.5 | D1.2 v4.62,30.07
  Bottom 0.305: C2.1 17.75,58.87 v17.78,57.33 | U4.8 C8.1 | U5.20 C11.1 | U6.28 C9.1 | U7.28 C10.1 | v42.23,54.61 R12.2 | v42.23,59.69 R11.2 | v42.23,64.77 R10.2 | U3.7 v19.05,22.23
  pour Power (isolate 0.203, rank 6): 0,73.66 127,73.66 127,0 0,0
5V_IN  (via drill 0.41)
  Top 0.305: v17.1,18.25 17.45,18.61 17.45,18.73 | 17.45,18.73 U1.18 | v16.51,22.23 17.14,22.23 17.46,21.91 17.46,18.74 17.45,18.73
  Top 0.406: v3.17,38.13 J1.1
  Power 0.305: v16.51,22.23 7.94,22.23 6.67,23.5 6.67,35.88 4.42,38.13 v3.17,38.13
  Bottom 0.305: v16.51,22.23 U3.2 C6.1 | v17.1,18.25 16.93,18.32 C1.1
  Bottom 0.61: 17.01,19.51 C1.1 | 16.75,19.25 C1.1 | 17,19.36 C1.1
A0  (4 unrouted)
A1  (4 unrouted)
A2  (3 unrouted)
A3  (3 unrouted)
A4  (4 unrouted)
A5  (3 unrouted)
A6  (3 unrouted)
A7  (3 unrouted)
A8  (3 unrouted)
A9  (3 unrouted)
A10  (3 unrouted)
A11  (3 unrouted)
A12  (4 unrouted)
A13  (3 unrouted)
A14  (3 unrouted)
A15  (2 unrouted)
CA1  (1 unrouted)
CA2  (1 unrouted)
CB1  (1 unrouted)
CB2  (1 unrouted)
CLEAR  (via drill 0.41 pad 0.81)
  Top 0.203: U2.4 16.83,57.82 v16.51,57.5 | v17.14,50.16 16.79,50.16 arc45 16.64,50.1 U8.49
  Ground 0.203: v16.51,57.5 16.51,50.8 v17.14,50.16
CLK12MHZ  (via drill 0.41)
  Top 0.203: U1.23 v20.7,18.25 | v17.14,36.2 16.83,36.2 arc-45 16.61,36.28 U8.16
  Ground 0.203: v20.7,18.25 20.7,32.63 v17.14,36.2
D0  (4 unrouted)
D1  (4 unrouted)
D2  (4 unrouted)
D3  (4 unrouted)
D4  (4 unrouted)
D5  (4 unrouted)
D6  (4 unrouted)
D7  (4 unrouted)
DA  (1 unrouted)
FIFO_DATA0  (1 unrouted)
FIFO_DATA1  (1 unrouted)
FIFO_DATA2  (1 unrouted)
FIFO_DATA3  (1 unrouted)
FIFO_DATA4  (1 unrouted)
FIFO_DATA5  (1 unrouted)
FIFO_DATA6  (1 unrouted)
FIFO_DATA7  (1 unrouted)
FIFO_RD  (1 unrouted)
FIFO_RXF  (1 unrouted)
FIFO_TXE  (1 unrouted)
FIFO_WR  (1 unrouted)
GND  (via drill 0.36, 0.41, 0.41 pad 0.81)  (1 unrouted)
  Top 0.305: 4.03,33.2 J1.6 | CLEAR.4 17.26,62.75 17.78,62.23 | 17.78,62.23 U2.2 | RESET.3 18.3,62.75 17.78,62.23 | C5.2 28.75,59 29.48,59.73 RESET.4 | C4.2 6.75,59 6.03,59.73 CLEAR.3 | J1.5 4.77,35.5 | J2.3 J2.5 J2.7 | J2.7 J2.9 J2.11 | U8.15 U8.14 16.51,38.02 16.51,38.73 v16.19,39.05 | v19.68,39.37 19.68,38.93 arc45 19.77,38.71 U8.21 U8.20 | U8.41 20.6,46.35 v20.48,46.2 | v13.97,4.76 J2.7 | v18.5,18.25 18.11,18.64 U1.19 | U8.62 12.94,44.13 v13.02,44.13 | v22.54,44.15 22.54,44.76 U8.36 | U8.18 18.57,37.79 v18.57,38.26 | R8.1 v4.62,31.57 | U8.54 15.59,47.14 v16.02,47.14 | U8.27 21.75,40.98 v21.75,41.43
  Top 0.406: v3.17,35.53 J1.5 | v17.79,27.5 18.11,27.18 U1.6
  Bottom 0.305: v17.75,62.25 17.75,60.57 C2.2 | v42.23,49.53 C8.2 | v65.09,19.05 C11.2 | v92.39,67.31 C9.2 | v115.25,67.31 C10.2 | 15.18,20.89 U3.1 v16.51,20.95 | 21.13,47.8 arc-45 C15.2 20.48,47.08 v20.48,46.2 | 14.43,38.56 arc-45 C14.2 15.17,39.37 15.88,39.37 v16.19,39.05 | v18.5,18.25 18.63,18.38 C1.2 | 17,26.42 17,27.25 17.25,27.5 v17.79,27.5 | C12.2 20.39,39.37 v19.68,39.37 | C13.2 15.03,47.14 v16.02,47.14 | v9.84,23.5 C7.2 C6.2
  Bottom 0.61: 18.75,19.31 C1.2 | 16.75,26.53 C3.2 17,26.42
  pour Ground (isolate 0.203): 0,73.66 127,73.66 127,0 0,0
IRQ  (1 unrouted)
  Bottom 0.203: R11.1 U4.4
N$1
  Top 0.305: R8.2 D1.1
N$1_N  (1 unrouted)
  Top 0.203: 6.32,37.75 5.75,37.75 5.48,37.48 J1.2
N$1_P
  Top 0.203: R2.1 5.75,36.58 5.42,36.83 J1.3
N$2
  Top 0.305: R6.1 11.75,66.61 12.45,67.31 13.91,67.31 CLEAR.2
N$2_N  (via drill 0.41)
  Top 0.203: v8.62,37.73 R1.2 | U1.14 14.86,18.39 v15,18.25
  Ground 0.203: v15,18.25 15,32.12 9.54,37.73 v8.62,37.73
N$2_P  (via drill 0.41)
  Top 0.203: v8.62,36.58 R2.2 | U1.13 14.21,18.45 v14,18.25
  Ground 0.203: v14,18.25 14,32.12 9.54,36.58 v8.62,36.58
N$3
  Top 0.305: R7.1 23.75,66.67 23.11,67.31 21.59,67.31 RESET.1
N$4  (1 unrouted)
  Top 0.203: 12.15,59 13.5,59 15.4,60.9 U2.3
  Top 0.305: R6.2 11.6,59 C4.1 R4.1
N$5
  Top 0.203: 23.6,59 22,59 20.1,60.9 U2.1
  Top 0.305: C5.1 25.5,58.65 | C5.1 R5.1 | C5.1 24.15,59 R7.2 23.6,59
NMI  (1 unrouted)
  Bottom 0.203: R12.1 U4.6
PA0  (1 unrouted)
PA1  (1 unrouted)
PA2  (1 unrouted)
PA3  (1 unrouted)
PA4  (1 unrouted)
PA5  (1 unrouted)
PA6  (1 unrouted)
PB0  (1 unrouted)
PB1  (1 unrouted)
PB2  (1 unrouted)
PB3  (1 unrouted)
PB4  (1 unrouted)
PB5  (1 unrouted)
PB6  (1 unrouted)
PHI0  (2 unrouted)
PHI1  (1 unrouted)
PHI2  (3 unrouted)
PWREN  (via drill 0.41)
  Top 0.203: U1.22 20.05,23.77 v19.05,24.77 v16.51,24.77 v16.52,24.77
  Ground 0.203: v16.52,24.77 v16.51,24.77
  Bottom 0.203: U3.5 v19.05,24.77 | R9.1 U3.4
  Bottom 0.305: U3.4 v16.51,24.77
R  (1 unrouted)
RDY  (1 unrouted)
  Bottom 0.203: R10.1 U4.2
RESET  (via drill 0.41 pad 0.81)  (3 unrouted)
  Top 0.203: U2.6 18.73,57.82 v19.05,57.5 | v18.41,50.16 18.77,50.16 arc-45 18.92,50.1 U8.48
  Ground 0.203: v19.05,57.5 19.05,50.8 v18.41,50.16
RW  (4 unrouted)
S  (1 unrouted)
SYNC  (1 unrouted)
T  (1 unrouted)
TCK  (via drill 0.41, 0.41 pad 0.81)
  Top 0.203: v11.5,8.89 11.97,9.36 J2.6 12,11.04 v12,13.02 | v24.92,40.32 24.53,40.32 U8.30
  Ground 0.203: v12,13.02 14.22,14.92 22.54,14.92 24.91,17.46 v24.92,40.32
  Bottom 0.203: R3.1 v11.5,8.89
TDI  (via drill 0.41 pad 0.81)
  Top 0.203: J2.10 16,11.02 v16,13.02 | U8.28 22.54,40.89 v22.54,42.2
  Ground 0.203: v16,13.02 17.27,14.29 22.86,14.29 25.72,17.46 25.72,41.12 24.63,42.2 v22.54,42.2
TDO  (via drill 0.41 pad 0.81)
  Top 0.203: J2.8 14,11.02 v14,13.02 | U8.53 14.37,49.07 v13.82,49.07
  Ground 0.203: v14,13.02 15.24,11.75 21.27,11.75 26.51,17.46 26.31,41.79 24.92,43.18 15.8,43.18 13.89,45.09 v13.82,49.07
TMS  (via drill 0.41, 0.41 pad 0.81)
  Top 0.203: J2.4 10,11.02 v10,13.02 | v24.13,39.53 24.13,40.01 U8.29
  Ground 0.203: v24.13,39.53 24.13,17.46 22.23,15.56 13.18,15.56 v10,13.02
X  (2 unrouted)
Y  (2 unrouted)
Z  (1 unrouted)
(copper drawn outside any net)
  shapes: Top area x1